# Altium schematic sheet flash.SchDoc: Flash Section
size A4; Author: Marcel Hellwig; Organization: Hamburg Bit-Bots; Address1: Vogt-Kölln-Str. 30; Address2: 22527 Hamburg; Address3: Germany; Address4: www.bit-bots.de; DocumentNumber: 16; SheetNumber: 16; SheetTotal: 16; EMail: info@bit-bots.de
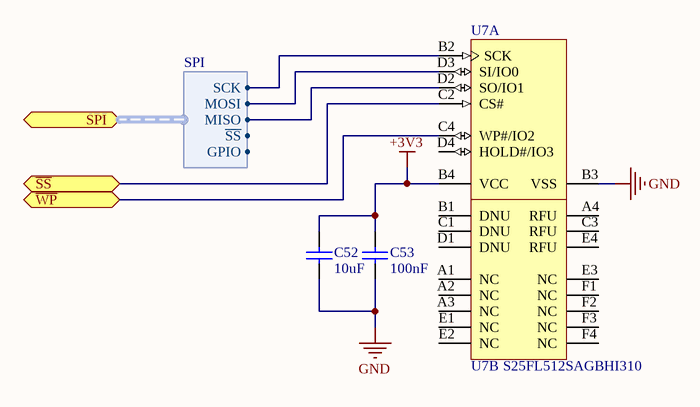
[diagram p0: flash.SchDoc]

## Parts
C52  10uF  [C2012]
C53  100nF  [C2012]
U7  S25FL512SAGBHI310  [SPSN-FAC024]  (value not drawn)  (parts A,B of 2)

## Ports
SPI (harness SPI), ~{SS} (bidir), ~{WP} (bidir)

## Harnesses
SPI: ~{SS}, GPIO, MISO, MOSI, SCK

## Nets
+3V3: C52.1 C53.1 U7.B4(VCC)
GND: C52.2 C53.2 U7.B3(VSS)
~{SS}: U7.C2(CS#) ; port ~{SS}
~{WP}: U7.C4(WP#/IO2) ; port ~{WP}
NetU7_B2: U7.B2(SCK) ; port SPI.SCK
NetU7_D2: U7.D2(SO/IO1) ; port SPI.MISO
NetU7_D3: U7.D3(SI/IO0) ; port SPI.MOSI

Not connected (* = marked no-connect by the designer): U7 A1(NC) A2(NC) A3(NC) A4(RFU) B1(DNU) C1(DNU) C3(RFU) D1(DNU) D4(HOLD#/IO3) E1(NC) E2(NC) E3(NC) E4(RFU) F1(NC) F2(NC) F3(NC) F4(NC)

## Notes on the sheet
- Project:
- Author:
- Title:
- Rev:
- Date:
- Time:
- Sheet
- of

## Library data of the parts
C52 = Cap: Capacitor; Manufacturer: MULTICOMP; Manufacturer Part Number: MC0805X106K250CT; Produktpalette: Baureihe MC; Kapazität: 10; Kapazitätstoleranz: ±10%; Dielektrikum: X5; Nennspannung: 25; Keramikkondensatorgehäuse: 0805 [Metrisch 2012]; Betriebstemperatur, min.: -55; Betriebstemperatur, max.: 85; Verpackung: Gurtabschnitt; Kondensatoranschlüsse: SMD<!--FANDB--><div class="features-and-benefits-container"></div>; Published: 8-Jun-2000; LatestRevisionDate: 17-Jul-2002; LatestRevisionNote: Re-released for DXP Platform.; PackageReference: RAD-0.3; Publisher: Altium Limited; PackageDescription: Radial Cap, Thru-Hole; 2 Leads; 0.3 in Pin Spacing; Value: 10uF; Supplier 1: Farnell; Supplier Part Number 1: 2320833; RoHS: YES; Stock 1: 46180; Pricing 1: 10=0,147, 100=0,121, 500=0,1, 1000=0,083, 1500=0,066 (EUR); MSL: MSL 1 - unbegrenzt; Bauform: 0805 [Metrisch 2012]; Kapazitätstoleranz ±: ±10%; ComponentLink1URL: http://www.farnell.com/datasheets/1870456.pdf; ComponentLink1Description: http://www.farnell.com/datasheets/1870456.pdf
C53 = Cap: Capacitor; Manufacturer: MULTICOMP; Manufacturer Part Number: MC0805B104K500CT; Produktpalette: Baureihe MC; Kapazität: 0.1; Kapazitätstoleranz: ±10%; Dielektrikum: X7; Nennspannung: 50; Keramikkondensatorgehäuse: 0805 [Metrisch 2012]; Betriebstemperatur, min.: -55; Betriebstemperatur, max.: 125; Verpackung: Gurtabschnitt; SVHC: No SVHC (17-Dec-2014); Betriebstemperatur: -55°C bis +125; Kondensatoranschlüsse: SMD<!--FANDB--><div class="features-and-benefits-container"></div>; Published: 8-Jun-2000; LatestRevisionDate: 17-Jul-2002; LatestRevisionNote: Re-released for DXP Platform.; PackageReference: RAD-0.3; Publisher: Altium Limited; PackageDescription: Radial Cap, Thru-Hole; 2 Leads; 0.3 in Pin Spacing; Value: 100nF; Supplier 1: Farnell; Supplier Part Number 1: 1759265; RoHS: YES; Stock 1: 692437; Pricing 1: 10=0,013, 100=0,011, 500=0,009, 1000=0,008, 2000=0,006 (EUR); MSL: -; Bauform: 0805 [Metrisch 2012]; Kapazitätstoleranz ±: ±10%; ComponentLink1URL: http://www.farnell.com/datasheets/1870456.pdf; ComponentLink1Description: http://www.farnell.com/datasheets/1870456.pdf
U7 = CMP-1329-00014-1: MirrorBit Flash Non-Volatile Memory CMOS 3.0 Volt Core with Versatile I/O, Serial Peripheral Interface with Multi-I/O, 128 Mbit, 133 MHz, -40 to 85 degC, 24-Ball BGA (FAC024), RoHS, Tray; PartNumber: S25FL128SAGBHI310; Manufacturer: Spansion; Speed: 133 MHz; OTP: 1024 B; VCC: 2.7 to 3.6 V; Packing: Tray; ComponentLink2Description: Datasheet; ComponentLink1Description: Manufacturer URL; ComponentLink3URL: http://www.spansion.com/Support/Datasheets/S25FL128S_256S_00.pdf; PackageDescription: 24-Ball Ball Grid Array, Body 6 x 8 mm, Pitch 1 mm; Temperature Range: -40 to 85 degC; Density: 128 Mbit; Mounting Technology: Surface Mount; RoHS: TRUE; ComponentLink1URL: http://www.spansion.com/Pages/Default.aspx; ComponentLink3Description: Package Specification; DatasheetVersion: Rev. 08; ComponentLink2URL: http://www.spansion.com/Support/Datasheets/S25FL128S_256S_00.pdf; PartId: 1; Supplier 1: Farnell; Supplier Part Number 1: 2340547